# EAGLE schematic ATtiny85 (EAGLE 8.6.1)
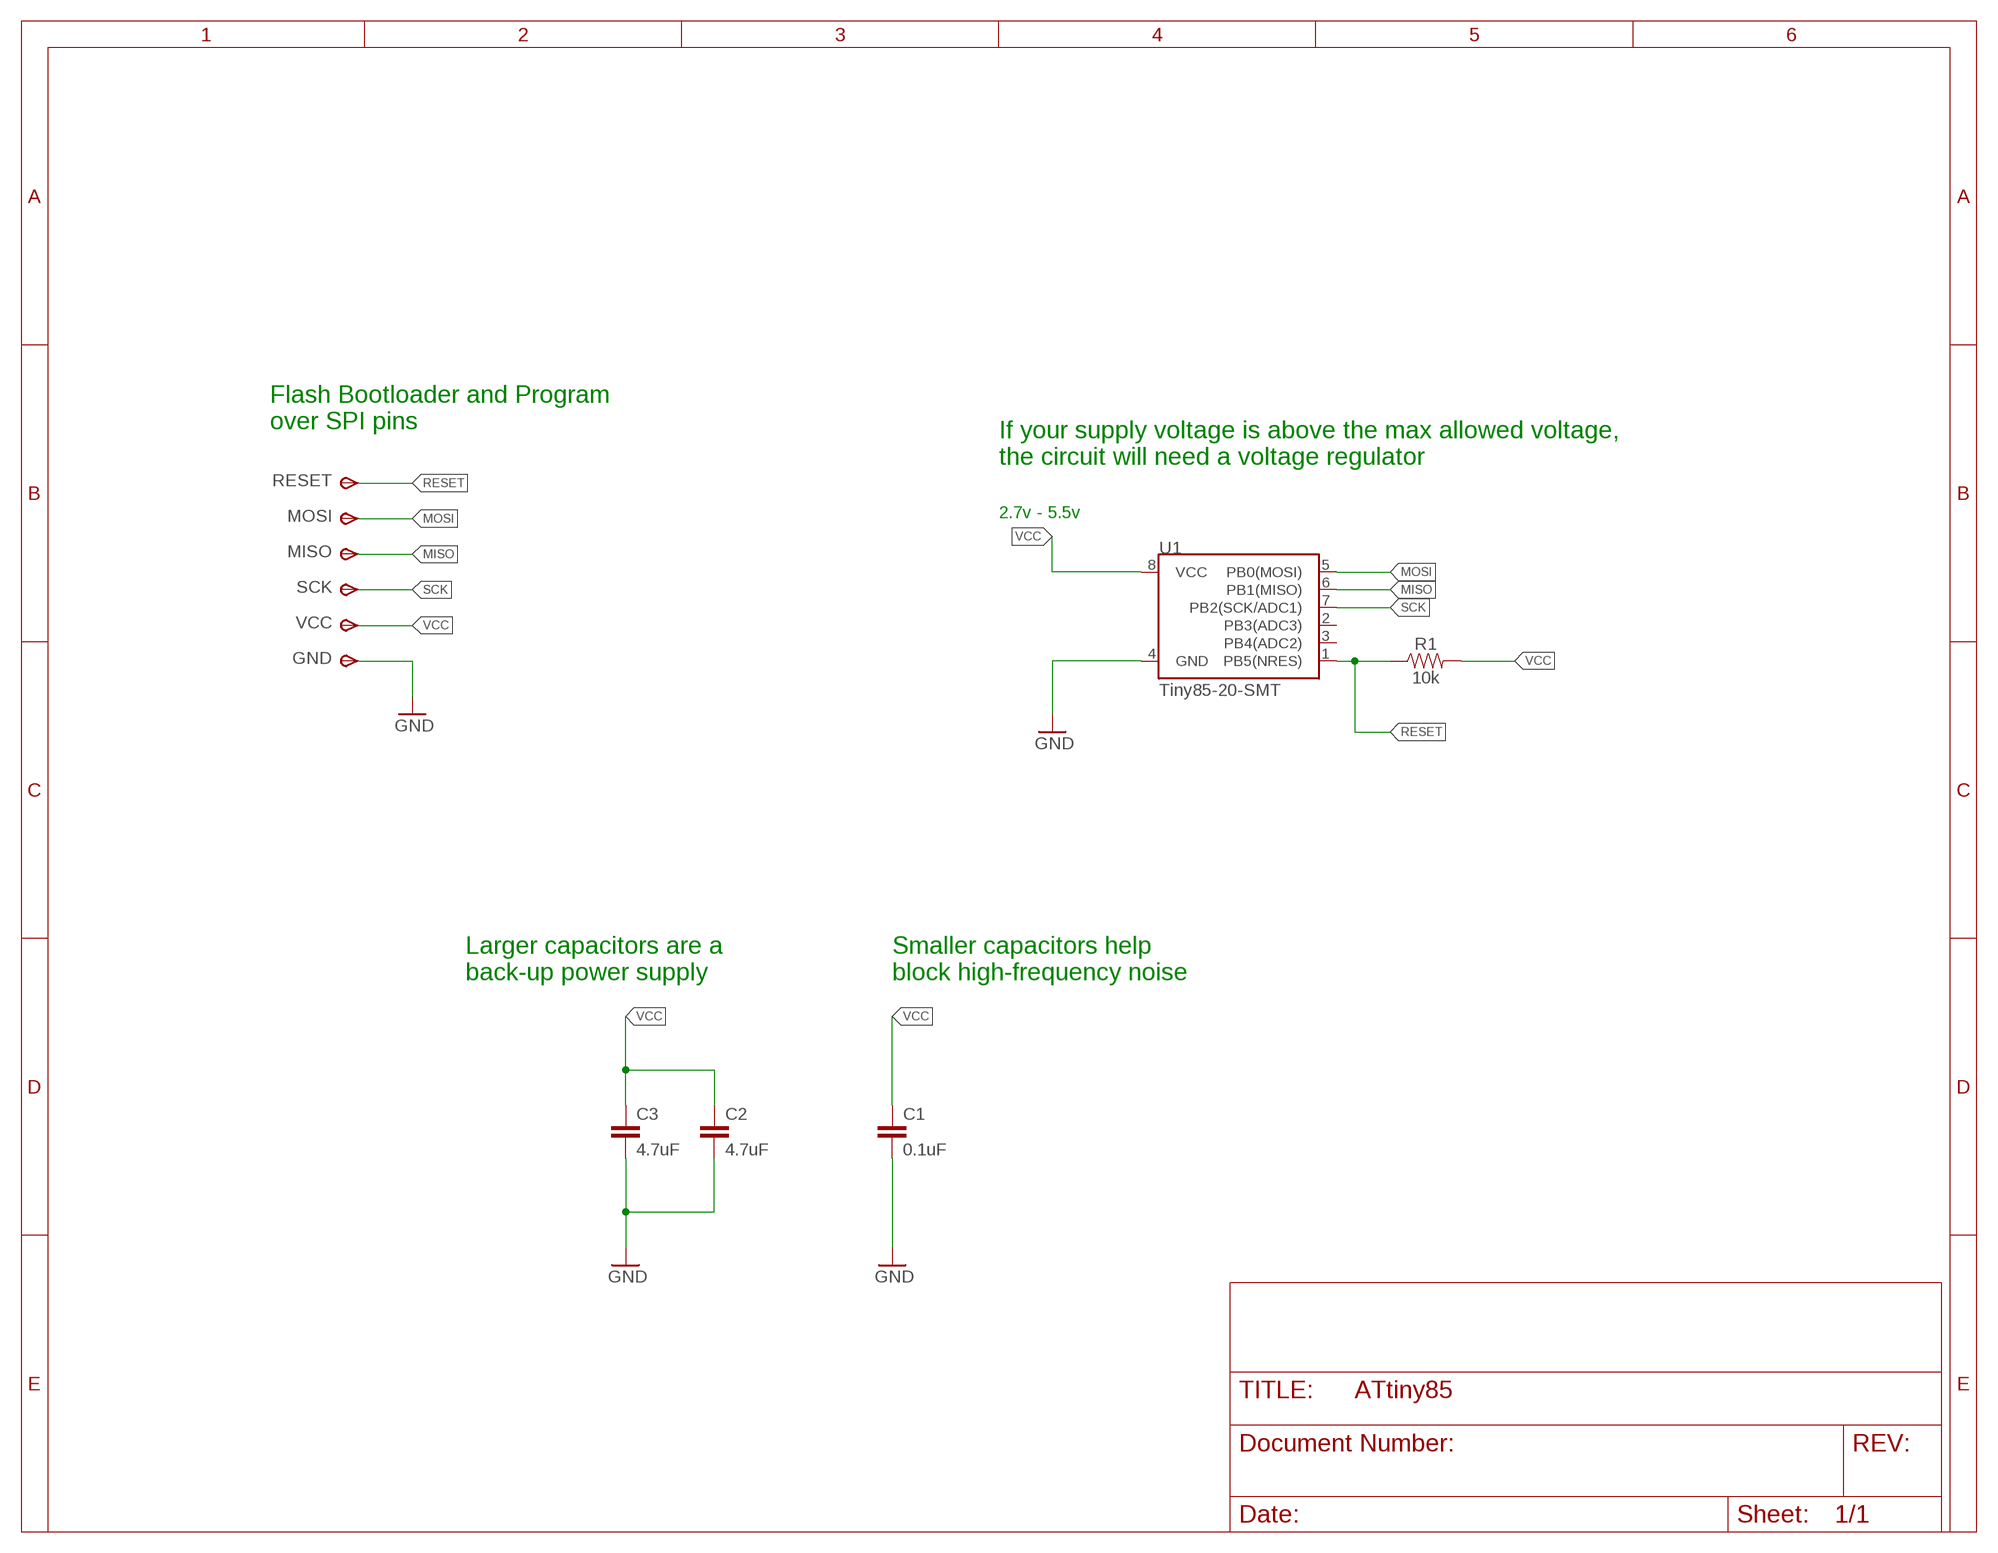
[diagram p0: schematic, sheet 1]

## Parts
C1  0.1uF  0.1UF-0603-25V-5%  [0603]
C2  4.7uF  4.7UF0603  [0603]
C3  4.7uF  4.7UF0603  [0603]
GND  TPSTP14SQ  [TP14SQ]
MISO  TPSTP14SQ  [TP14SQ]
MOSI  TPSTP14SQ  [TP14SQ]
R1  10k  10KOHM-0603-1/10W-1%  [0603]
RESET  TPSTP14SQ  [TP14SQ]
SCK  TPSTP14SQ  [TP14SQ]
U1  Tiny85-20-SMT  ATTINY45TINY85-20-SMT  [SO08-EIAJ_MCU]
VCC  TPSTP14SQ  [TP14SQ]

## Nets
GND: C1.2 C2.2 C3.2 GND.TP(PP) U1.4(GND)
MISO: MISO.TP(PP) U1.6(PB1(MISO))
MOSI: MOSI.TP(PP) U1.5(PB0(MOSI))
RESET: R1.1 RESET.TP(PP) U1.1(PB5(NRES))
SCK: SCK.TP(PP) U1.7(PB2(SCK/ADC1))
VCC: C1.1 C2.1 C3.1 R1.2 U1.8(VCC) VCC.TP(PP)
Unconnected: U1.2(PB3(ADC3)) U1.3(PB4(ADC2))

## Notes on the sheet
- Flash Bootloader and Program
  over SPI pins
- If your supply voltage is above the max allowed voltage,
  the circuit will need a voltage regulator
- 2.7v - 5.5v
- Larger capacitors are a
  back-up power supply
- Smaller capacitors help
  block high-frequency noise

## Library data of the parts
C1 = SparkFun-Capacitors:0.1UF: 0.1µF ceramic capacitors A capacitor is a passive two-terminal electrical component used to store electrical energy temporarily in an electric field.; PROD_ID: CAP-08604
C2 C3 = SparkFun-Capacitors:4.7UF: 4.7µF ceramic capacitors A capacitor is a passive two-terminal electrical component used to store electrical energy temporarily in an electric field.; PROD_ID: CAP-08280
GND MISO MOSI RESET SCK VCC = testpad:TPS: TEST PIN
R1 = SparkFun-Resistors:10KOHM: 10kΩ resistor A resistor is a passive two-terminal electrical component that implements electrical resistance as a circuit element. Resistors act to reduce current flow, and, at the same time, act to lower voltage levels within circuits. - Wikipedia; PROD_ID: RES-00824
U1 = SparkFun-Retired:ATTINY45: Atmel 8-pin 2/4/8kB flash uC Retired; PROD_ID: IC-09092